# EasyEDA schematic SCH_New-Project_2026-06-15.json
TITLE: Sheet_1; REV: 1.0; Date: 2026-06-15; Sheet: 1/1; Drawn By: eda_jgdzoysd; Company: Your Company
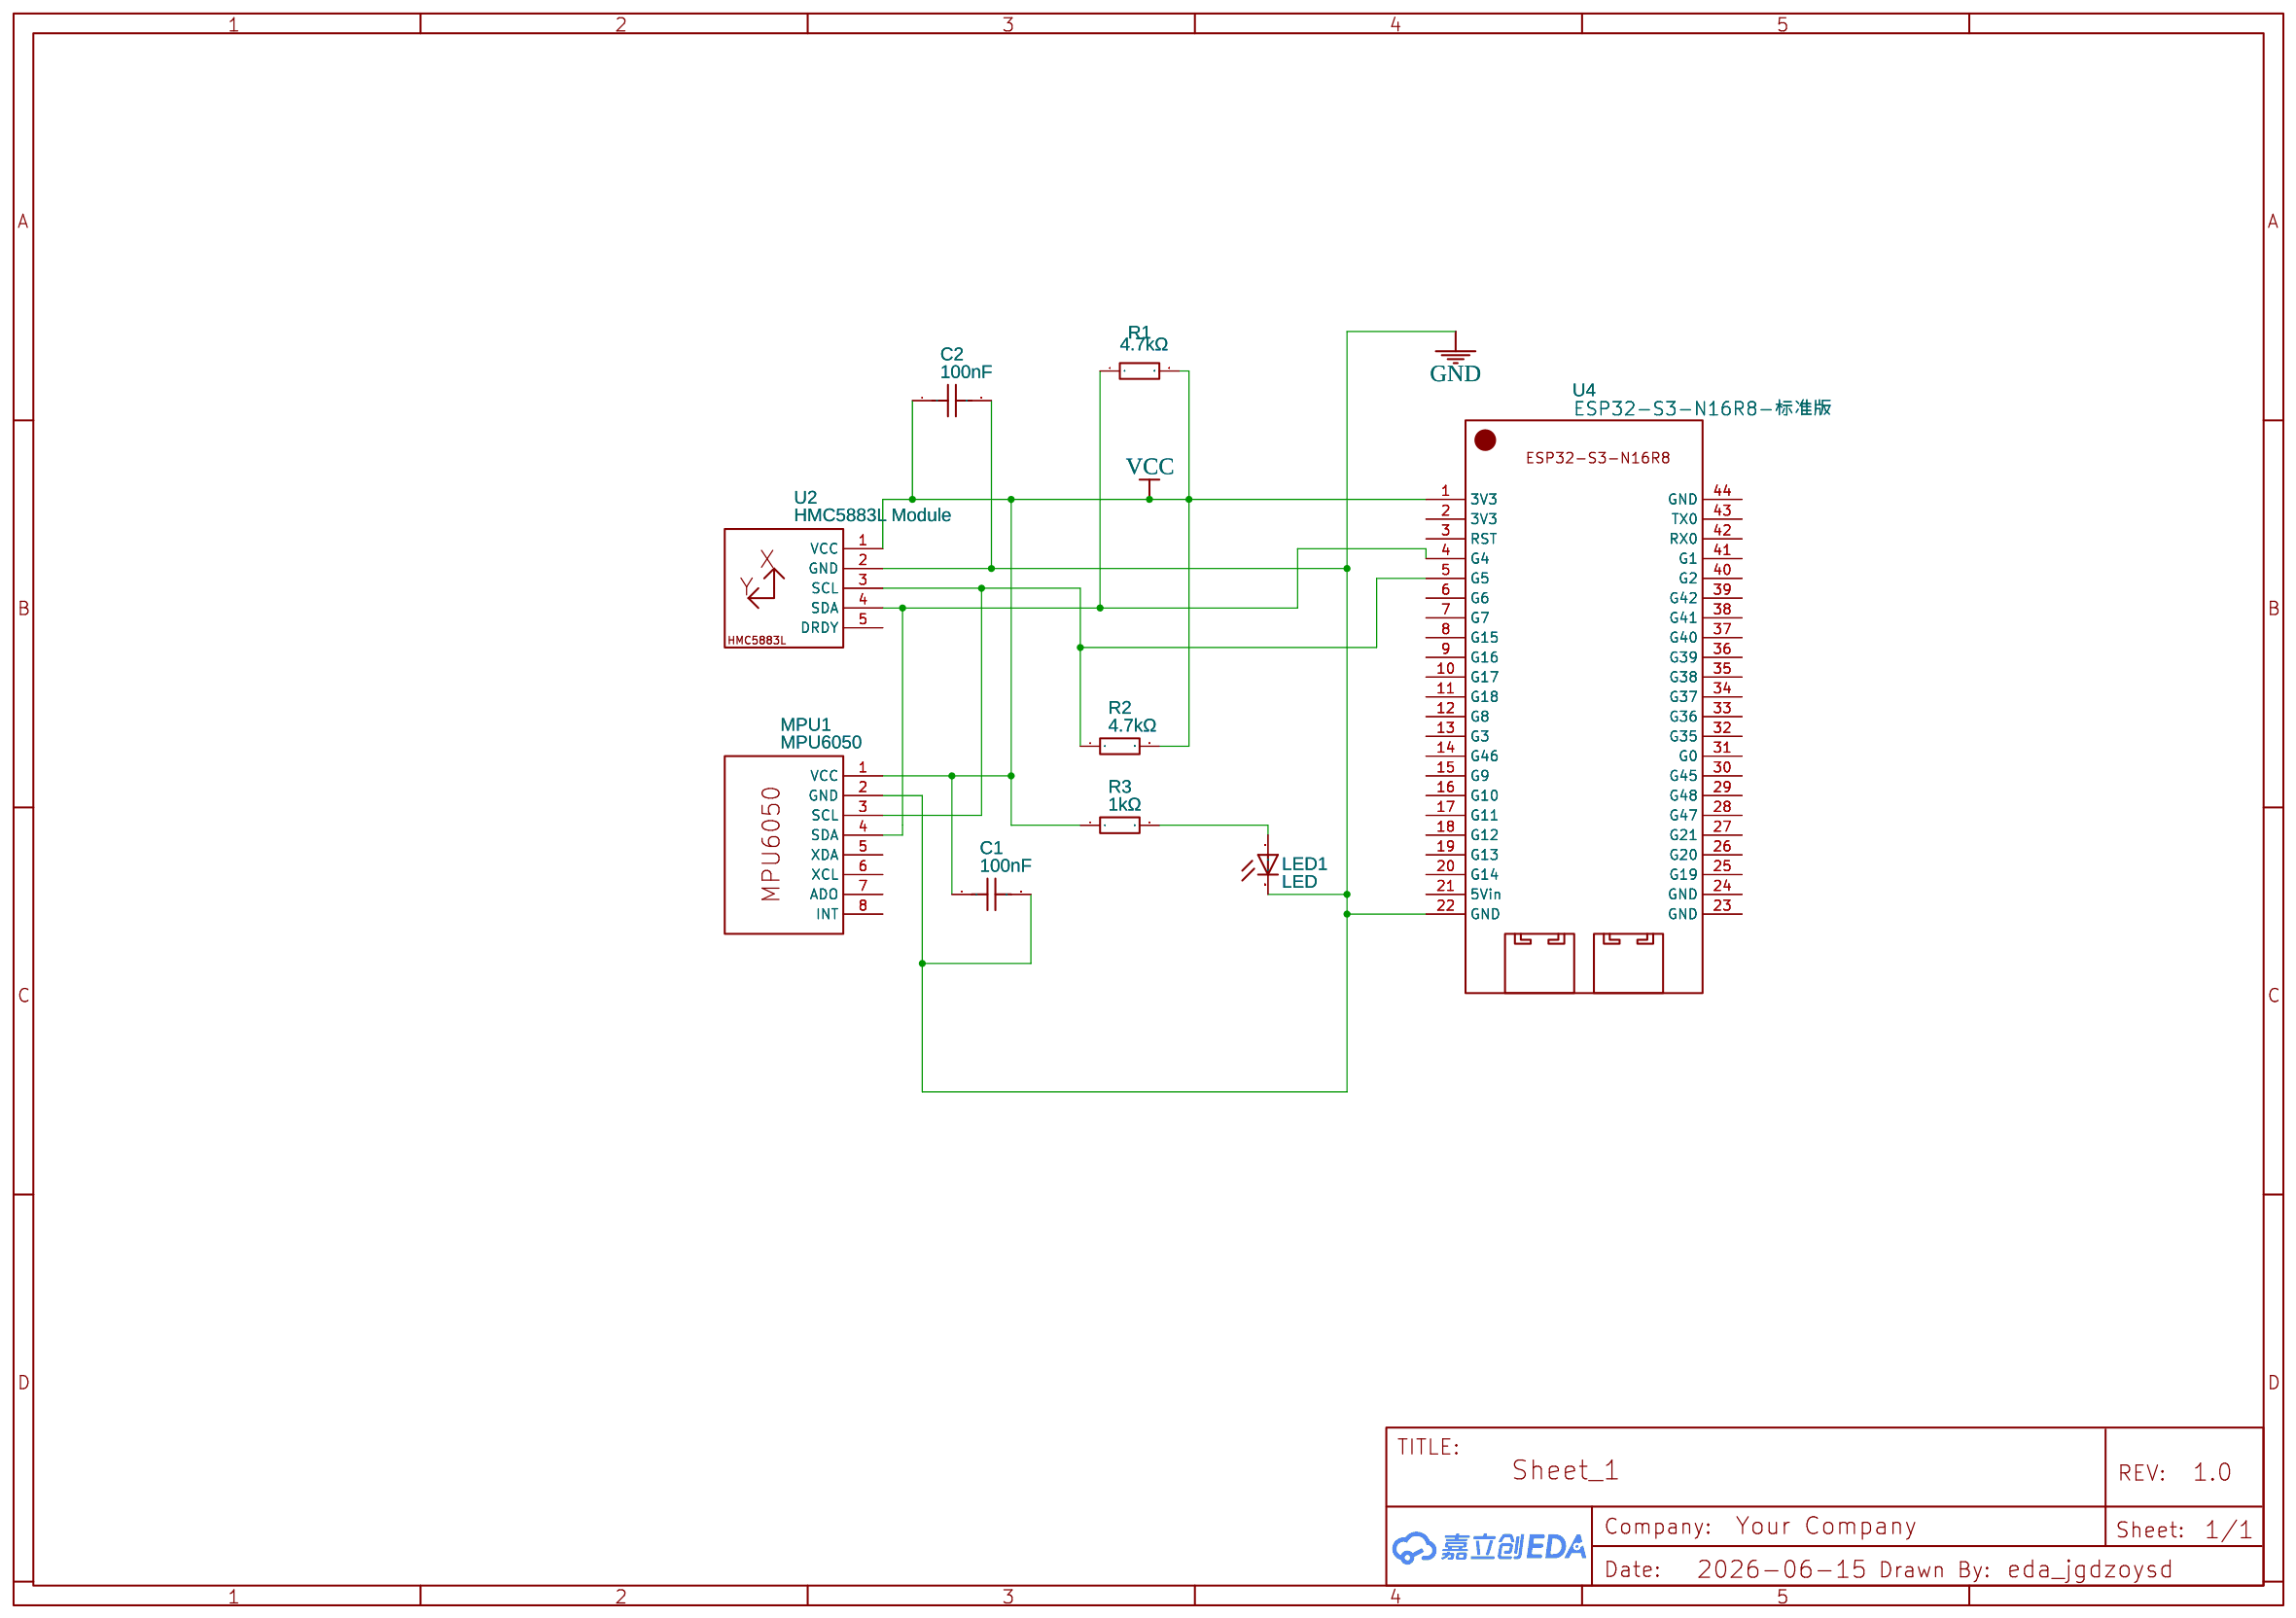
[diagram p0: schematic sheet]

## Parts
C1  100nF  [CAP-TH_L13.0-W7.5-P10.00-D0.6]
C2  100nF  [CAP-TH_L13.0-W7.5-P10.00-D0.6]
LED1  LED  [CHIPLED-0603-TTW]
MPU1  MPU6050  [MPU6050-丝印不可移]
R1  4.7kΩ  [R0603]
R2  4.7kΩ  [R0603]
R3  1kΩ  [RES-TH_BD7.0-L22.5-P26.50-D0.8]
U2  HMC5883L Module  [COMPASS-HMC5883L-MODULE]
U4  ESP32-S3-N16R8-标准版  [ESP32-S3-N16R8]

## Library data of the parts
C1 C2 = PMPR104J400D02: Supplier: LCSC; Manufacturer: TENTA(天泰); Supplier Part: C83129; JLCPCB Part Class: Extended Part
LED1 = LED: Contributor: Adafruit
MPU1 = MPU6050 有孔(锁定丝印): Contributor: hua-sheng
R1 R2 = LE03WAF470KT5E: Supplier: LCSC; Manufacturer: UNI-ROYAL(厚声); Supplier Part: C81085; JLCPCB Part Class: Extended Part
R3 = PCF2CT631R102K: Contributor: lcsc; Supplier: LCSC; Supplier Part: C782211; Manufacturer: KOA; JLCPCB Part Class: Extended Part
U2 = HMC5883L Module: Contributor: ZhangRiven; sourceId: vtnFWQ8qI
U4 = ESP32-S3-N16R8-标准版: Contributor: eda_yqwlvwdg

## Nets
GND: C1.2 C2.2 LED1.C@1(C) MPU1.2(GND) U2.2(GND) U4.22(GND)
VCC: C1.1 C2.1 MPU1.1(VCC) R1.2 R2.2 R3.1 U2.1(VCC) U4.1(3V3)
Net-(LED1-A@1): LED1.A@1(A) R3.2
Net-(MPU1-3): MPU1.3(SCL) R2.1 U2.3(SCL) U4.5(G5)
Net-(MPU1-4): MPU1.4(SDA) R1.1 U2.4(SDA) U4.4(G4)

Not connected (* = marked no-connect by the designer): MPU1 5(XDA) 6(XCL) 7(ADO) 8(INT); U2 5(DRDY); U4 2(3V3) 3(RST) 6(G6) 7(G7) 8(G15) 9(G16) 10(G17) 11(G18) 12(G8) 13(G3) 14(G46) 15(G9) 16(G10) 17(G11) 18(G12) 19(G13) 20(G14) 21(5Vin) 23(GND) 24(GND) 25(G19) 26(G20) 27(G21) 28(G47) 29(G48) 30(G45) 31(G0) 32(G35) 33(G36) 34(G37) 35(G38) 36(G39) 37(G40) 38(G41) 39(G42) 40(G2) 41(G1) 42(RX0) 43(TX0) 44(GND)
